# EAGLE design atem_tally_receiver (EAGLE 7.7.0)
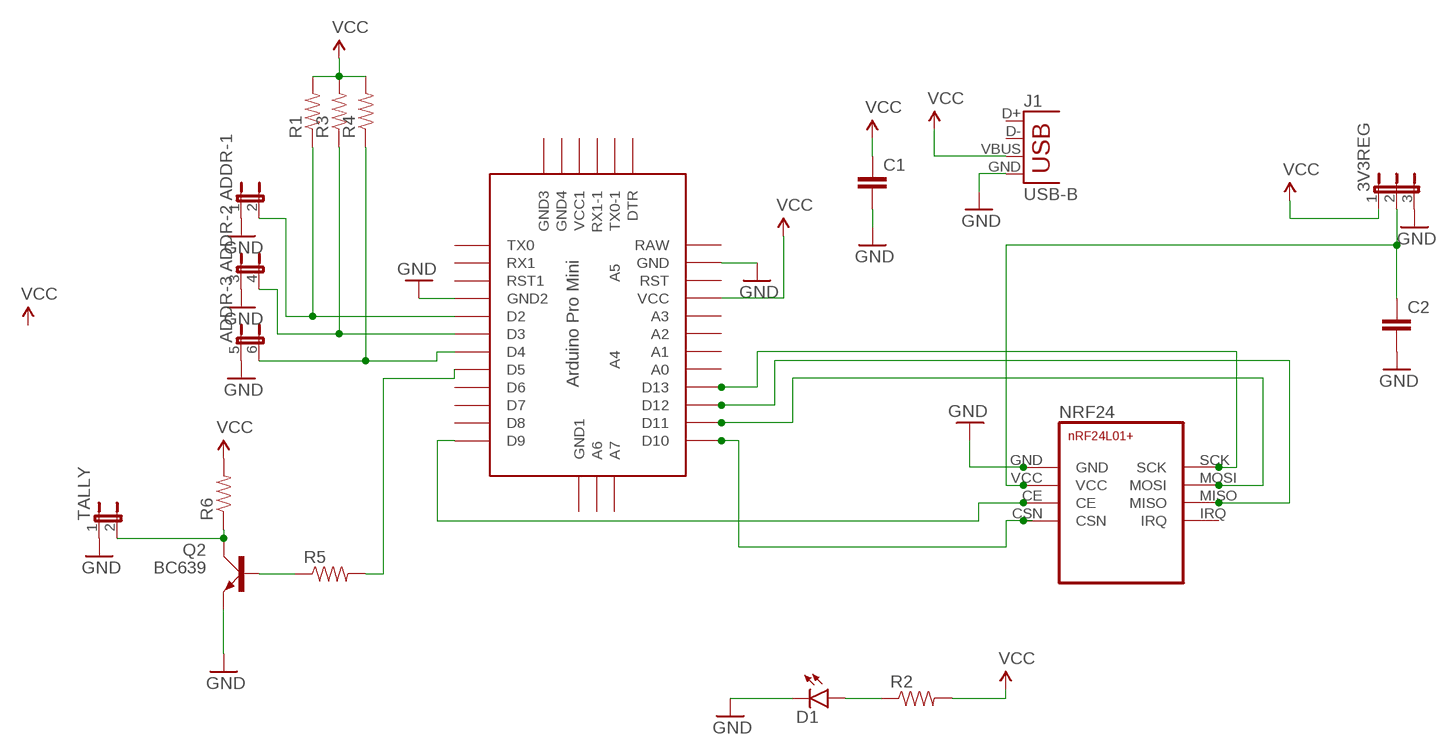
[diagram p0: schematic, sheet 1]

## Parts
3V3REG  JP2E  [JP2]
ADDR  JP3QE  [JP3Q]
C1  C-EU025-050X050  [C025-050X050]
C2  C-EU025-050X050  [C025-050X050]
D1  LED3MM  [LED3MM]
J1  USB-B  USBPTH  [USB-B-PTH]
NRF24  NRF24L01+  [NRF24L01+]
Q2  BC639  [SOT54D]
R1  RESISTORAXIAL-0.3  [AXIAL-0.3]
R2  RESISTORAXIAL-0.3  [AXIAL-0.3]
R3  RESISTORAXIAL-0.3  [AXIAL-0.3]
R4  RESISTORAXIAL-0.3  [AXIAL-0.3]
R5  RESISTORAXIAL-0.3  [AXIAL-0.3]
R6  RESISTORPTH-1W  [AXIAL-0.6]
TALLY  JP1E  [JP1]
U$1  ABK-PRO-MINI  [ABK-PRO-MINI]

## Nets
GND: 3V3REG.3 ADDR.1 ADDR.3 ADDR.5 C1.2 C2.2 D1.K(C) J1.GND NRF24.GND Q2.E TALLY.1 U$1.GND U$1.GND1(GND2)
N$1: NRF24.CE U$1.D9
N$2: NRF24.CSN U$1.D10
N$3: NRF24.SCK U$1.D13
N$4: NRF24.MOSI U$1.D11
N$5: NRF24.MISO U$1.D12
N$6: 3V3REG.2 C2.1 NRF24.VCC
N$7: ADDR.2 R1.P$1 U$1.D2
N$8: ADDR.4 R3.P$1 U$1.D3
N$9: ADDR.6 R4.P$1 U$1.D4
N$10: D1.A R2.P$1
N$11: Q2.B R5.P$1
N$12: R5.P$2 U$1.D5
N$13: Q2.C R6.P$1 TALLY.2
VCC: 3V3REG.1 C1.1 J1.VBUS R1.P$2 R2.P$2 R3.P$2 R4.P$2 R6.P$2 U$1.VCC
Unconnected: J1.D+ J1.D- NRF24.IRQ U$1.A0 U$1.A1 U$1.A2 U$1.A3 U$1.A4 U$1.A5 U$1.A6 U$1.A7 U$1.D6 U$1.D7 U$1.D8 U$1.DTR U$1.GND2(GND3) U$1.GND3(GND4) U$1.GND4(GND1) U$1.RAW U$1.RST U$1.RST1 U$1.RX1 U$1.RX1-1 U$1.TX0 U$1.TX0-1 U$1.VCC1

## Library data of the parts
3V3REG = jumper:JP2E: JUMPER
ADDR = jumper:JP3QE: JUMPER
C1 C2 = resistor:C-EU: CAPACITOR, European symbol
D1 = SparkFun-LED:LED: LEDs Standard schematic elements and footprints for 5mm, 3mm, 1206, and 0603 sized LEDs. 5mm - Spark Fun Electronics SKU : COM-00529 (and others); PROD_ID: DIO-08794
J1 = SparkFun-Connectors:USB: USB Connectors USB-B-PTH is fully proven SKU : PRT-00139/CONN-08278 USB-miniB is fully proven SKU : PRT-00587 USB-A-PCB is untested. USB-A-H is throughly reviewed, but untested. Spark Fun Electronics SKU : PRT-00437 USB-B-SMT is throughly reviewed, but untested. Needs silkscreen touching up. USB-A-S has not been used/tested USB-MB-H has not been used/tested USB-MICROB has been used. CONN-09505; PROD_ID: CONN-08278
NRF24 = nrf24l01:NRF24L01+: nRF24L01+ Transceiver Module
Q2 = transistor-small-signal:BC639: NPN TRANSISTOR
R1-R5 = SparkFun:RESISTOR: Resistor Basic schematic elements and footprints for 0603, 1206, and PTH resistors.
R6 = SparkFun-Passives:RESISTOR: Resistor Basic schematic elements and footprints for 0603, 1206, and PTH resistors.
TALLY = jumper:JP1E: JUMPER
U$1 = Arduino-clone:ABK-PRO-MINI: ABK Pro-Mini Arduino Clone

## Board
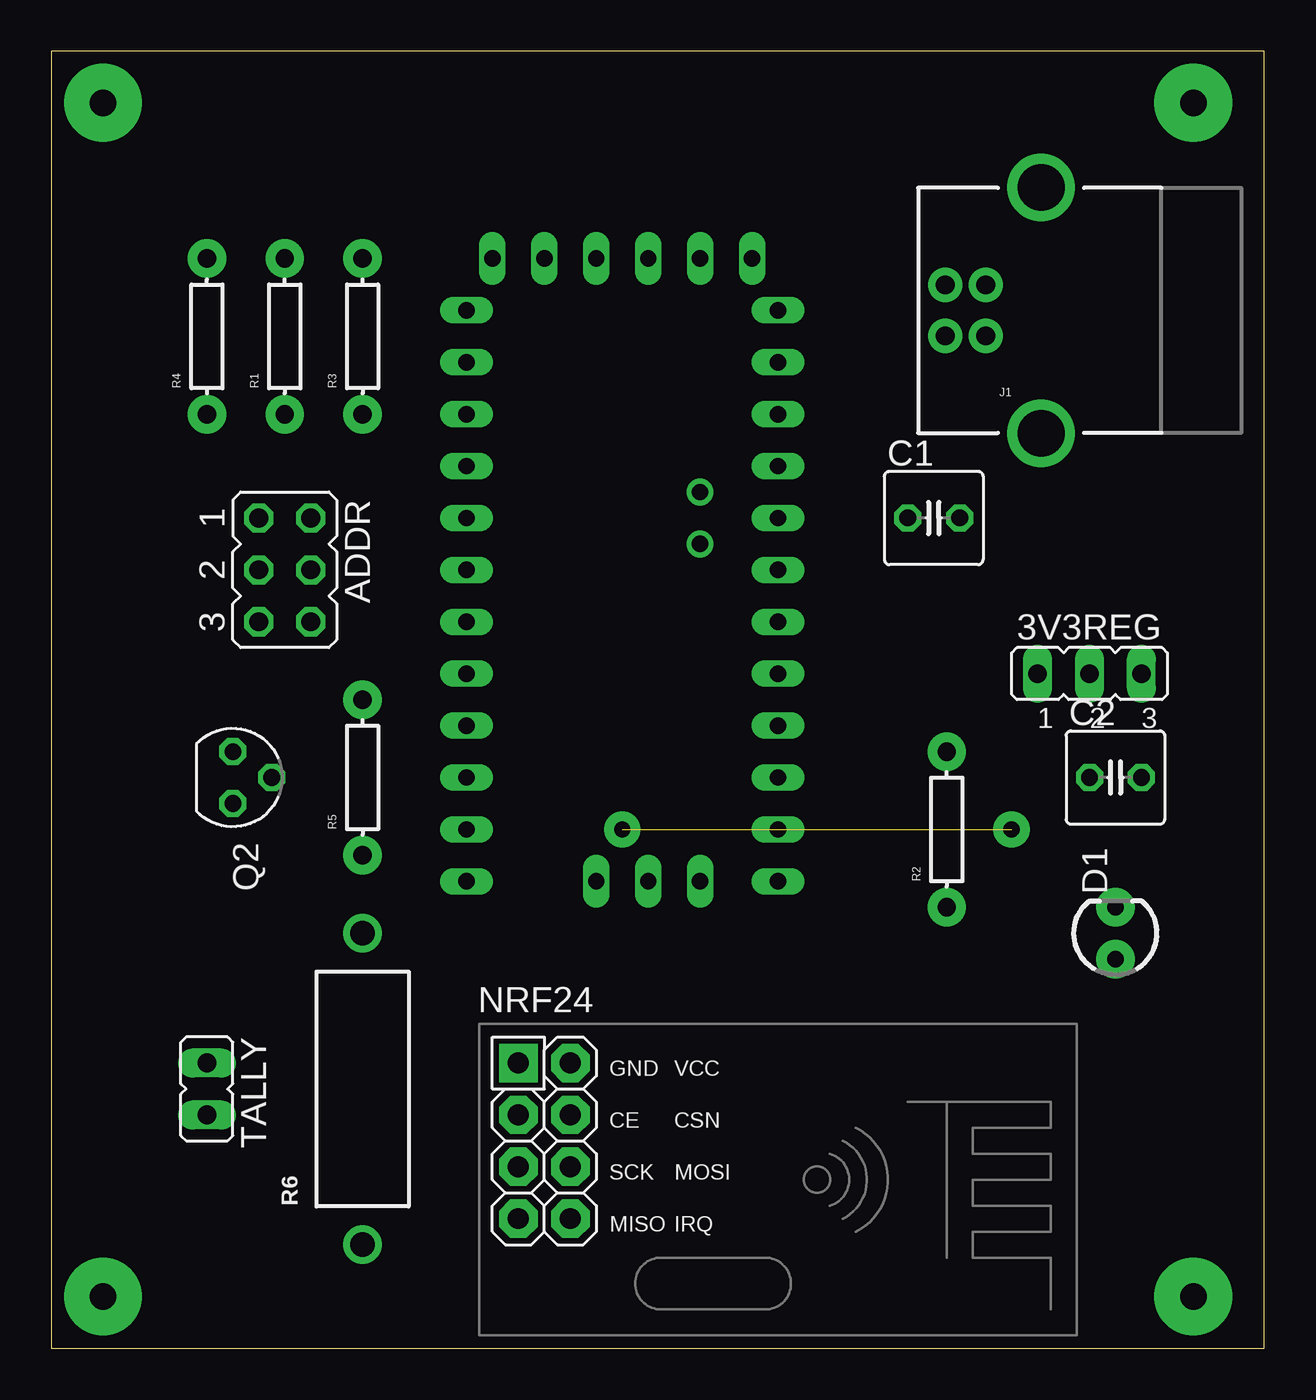
[diagram p1: board, top side]
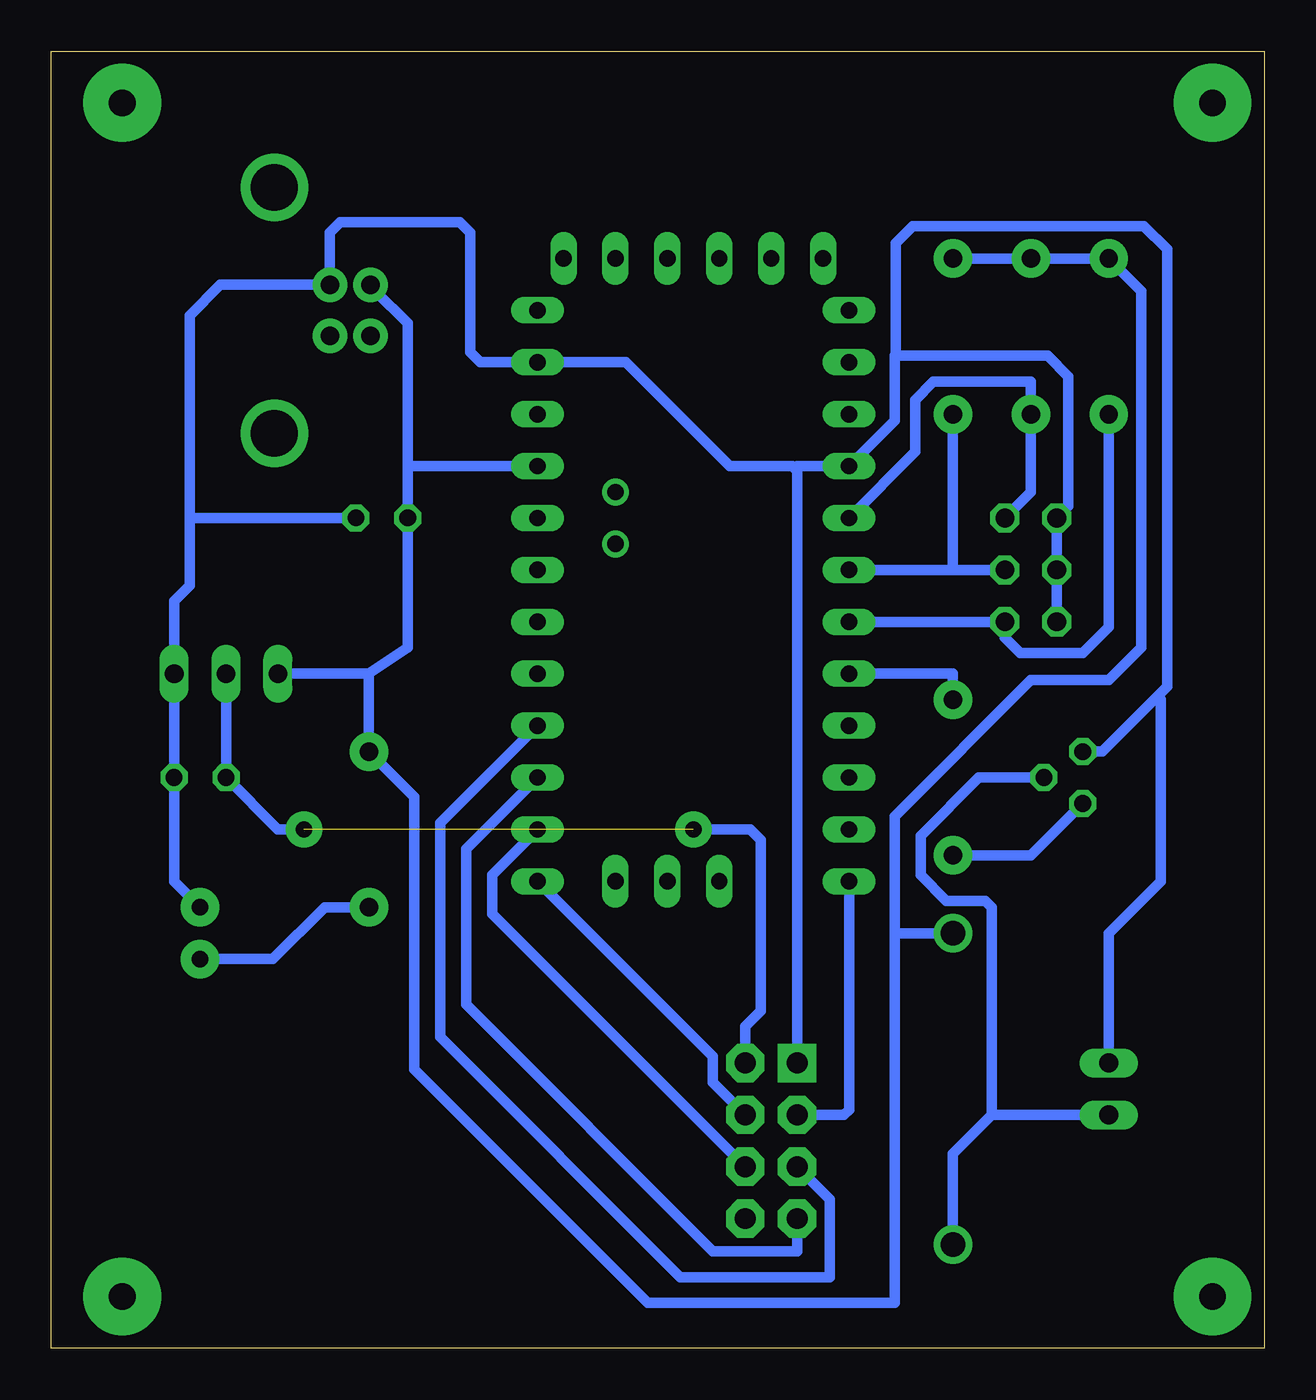
[diagram p2: board, bottom side, seen from below]

Size 59.36 x 63.49 mm. Coordinates in mm from the lower left corner, seen from the top.
Outline: 0,0 59.36,0 59.36,63.49 0,63.49 0,0
Copper layers (1*16): Top 0.035mm / dielectric 1.5mm / Bottom 0.035mm
Design rules "default *": minimum track width 20mil, minimum drill 24mil, track to track 20mil, track to pad 15mil, pad to pad 15mil, via to via 20mil, smd to smd 8mil, copper to edge 40mil, drill to drill 8mil, minimum pad ring 10mil, minimum via ring 8mil, stop-mask expansion 4mil, vias tented up to drill 0mil, thermal gap 10mil

### Footprints (pad centres in the part's own frame; a part is rotated, then mirrored left to right if it is on the bottom)
JP2 = drill 0.914 long: 1 -2.54,0; 2 0,0; 3 2.54,0
JP3Q = drill 0.914 octagon: 1 -2.54,-1.27; 2 -2.54,1.27; 3 0,-1.27; 4 0,1.27; 5 2.54,-1.27; 6 2.54,1.27
C025-050X050 = drill 0.813 octagon: 1 -1.27,0; 2 1.27,0
LED3MM = drill 0.813 pad 1.88: A -1.27,0; K 1.27,0
USB-B-PTH = drill 0.914 pad 1.676: D+ 0,1.25; D- 1.981,1.25; GND 0,-1.25; VBUS 1.981,-1.25 | drill 2.286: S1 -2.718,-6.02; S2 -2.718,6.02
NRF24L01+ = drill 1.016 pad 1.88 octagon: CE -11.43,1.27; CSN -8.89,1.27; IRQ -8.89,-3.81; MISO -11.43,-3.81; MOSI -8.89,-1.27; SCK -11.43,-1.27; VCC -8.89,3.81 | drill 1.016 pad 1.88 square: GND -11.43,3.81
SOT54D = drill 0.813 octagon: B 1.27,0; C 0,1.905; E -1.27,0
AXIAL-0.3 = drill 0.9 pad 1.88: P$1 -3.81,0; P$2 3.81,0
AXIAL-0.6 = drill 1.2 pad 1.88: P$1 -7.62,0; P$2 7.62,0
JP1 = drill 0.914 long: 1 0,-1.27; 2 0,1.27
ABK-PRO-MINI = drill 0.8 long: A0 10.16,-3.81; A1 10.16,-6.35; A2 10.16,-8.89; A3 10.16,-11.43; A6 3.81,-21.59; A7 6.35,-21.59; D2 -5.08,-3.81; D3 -5.08,-6.35; D4 -5.08,-8.89; D5 -5.08,-11.43; D6 -5.08,-13.97; D7 -5.08,-16.51; D8 -5.08,-19.05; D9 -5.08,-21.59; D10 10.16,-21.59; D11 10.16,-19.05; D12 10.16,-16.51; D13 10.16,-13.97; DTR 8.89,8.89; GND 10.16,3.81; GND1 -5.08,-1.27; GND2 -3.81,8.89; GND3 -1.27,8.89; GND4 1.27,-21.59; RAW 10.16,6.35; RST 10.16,1.27; RST1 -5.08,1.27; RX1 -5.08,3.81; RX1-1 3.81,8.89; TX0 -5.08,6.35; TX0-1 6.35,8.89; VCC 10.16,-1.27; VCC1 1.27,8.89 | drill 0.8: A4 6.35,-5.08; A5 6.35,-2.54

### Placement (x,y rotation side)
3V3REG  50.8,33.02 0 top
ADDR  11.43,38.1 270 top
C1  43.18,40.64 0 top
C2  52.07,27.94 0 top
D1  52.07,20.32 90 top
J1  45.72,50.8 180 top
NRF24  34.29,10.16 0 top
Q2  8.89,27.94 270 top
R1  11.43,49.53 90 top
R2  43.81,25.4 90 top
R3  15.24,49.53 90 top
R4  7.62,49.53 90 top
R5  15.24,27.94 90 top
R6  15.24,12.7 90 top
TALLY  7.62,12.7 180 top
U$1  25.4,44.45 0 top

### Tracks (layer width: path | path; a pad name or v marks a point on that pad's centre or on a via)
GND
  Bottom 0.508: D1.K 53.34,22.86 C2.2 3V3REG.3 53.34,36.58 52.58,37.34 52.58,40.64 | ADDR.5 ADDR.3 ADDR.1 9.59,41.21 9.59,47.56 10.6,48.58 18.1,48.58 | 22.86,42.93 22.86,43.18 U$1.GND1 18.1,45.4 18.1,48.58 | 22.86,42.93 NRF24.GND | 45.72,52.07 J1.GND | 18.1,48.58 18.03,48.64 18.03,54.1 17.21,54.93 5.91,54.93 4.76,53.78 4.76,32.39 5.24,31.91 | J1.GND 51.07,52.05 52.58,50.55 52.58,40.64 | C1.2 52.58,40.64 | J1.GND 45.72,54.61 45.21,55.12 39.37,55.12 38.86,54.61 38.86,48.77 38.35,48.26 U$1.GND 31.24,48.26 26.16,43.18 23.11,43.18 22.86,42.93 | Q2.E 7.94,29.21 5.24,31.91 | TALLY.1 7.62,20.32 5.08,22.86 5.08,31.75 5.24,31.91
N$1
  Bottom 0.508: NRF24.CE 20.57,11.43 20.32,11.68 U$1.D9
N$2
  Bottom 0.508: U$1.D10 26.99,14.29 26.99,13.02 NRF24.CSN
N$3
  Bottom 0.508: U$1.D13 40.32,25.72 40.32,15.24 28.57,3.49 21.27,3.49 21.27,7.3 NRF24.SCK
N$4
  Bottom 0.508: U$1.D11 37.78,23.18 37.78,21.27 NRF24.MOSI
N$5
  Bottom 0.508: U$1.D12 39.05,24.45 39.05,16.83 26.99,4.76 22.86,4.76 NRF24.MISO
N$6  (1 unrouted)
  Bottom 0.508: 3V3REG.2 C2.1 48.26,25.4 46.99,25.4 | NRF24.VCC 25.4,15.75 24.64,16.51 24.64,24.89 25.15,25.4 27.94,25.4
N$7
  Bottom 0.508: U$1.D2 17.08,43.88 17.08,46.42 16.19,47.31 11.43,47.31 R1.P$1 11.43,41.91 ADDR.2
N$8
  Bottom 0.508: ADDR.4 15.24,38.1 | 15.24,38.1 U$1.D3 | 15.24,38.1 R3.P$1
N$9
  Bottom 0.508: U$1.D4 ADDR.6 12.7,34.8 11.94,34.04 8.89,34.04 7.62,35.31 R4.P$1
N$10
  Bottom 0.508: D1.A 48.51,19.05 45.97,21.59 R2.P$1
N$11
  Bottom 0.508: Q2.B 11.43,24.13 R5.P$1
N$12
  Bottom 0.508: U$1.D5 15.24,33.02 R5.P$2
N$13
  Bottom 0.508: Q2.C 13.97,27.94 16.83,25.08 16.83,23.18 15.56,21.91 13.65,21.91 13.33,21.59 13.33,11.43 | R6.P$1 15.24,9.52 13.33,11.43 | 13.33,11.43 TALLY.2
N$14  (via drill 0.8 pad 1.78)
  other vias: 46.99,25.4
N$15  (via drill 0.8 pad 1.78)
  other vias: 27.94,25.4
N$17  (via drill 1.3 pad 3.81)
  other vias: 55.88,60.96
N$18  (via drill 1.3 pad 3.81)
  other vias: 2.54,60.96
N$19  (via drill 1.3 pad 3.81)
  other vias: 2.54,2.54
N$20  (via drill 1.3 pad 3.81)
  other vias: 55.88,2.54
VCC
  Bottom 0.508: 43.81,33.02 3V3REG.1 | 43.81,33.02 R2.P$2 41.59,26.99 41.59,13.65 30.16,2.22 18.1,2.22 18.1,20.32 | 41.91,43.18 U$1.VCC | 41.91,43.18 C1.1 41.91,34.29 43.81,33.02 | 41.91,43.18 41.91,50.16 43.5,51.75 J1.VBUS | 18.1,20.32 R6.P$2 | 18.1,20.32 18.1,26.04 11.43,32.7 7.62,32.7 6.03,34.29 6.03,51.75 R4.P$2 R1.P$2 R3.P$2